# Altium schematic sheet SensorBoard.SchDoc: GROUND WATER MONITORING SYSTEM (part 1 of 2)
size C; DrawnBy: Md. Mizanur Rahman; Engineer: Md. Mizanur Rahman; Revision: 0.1
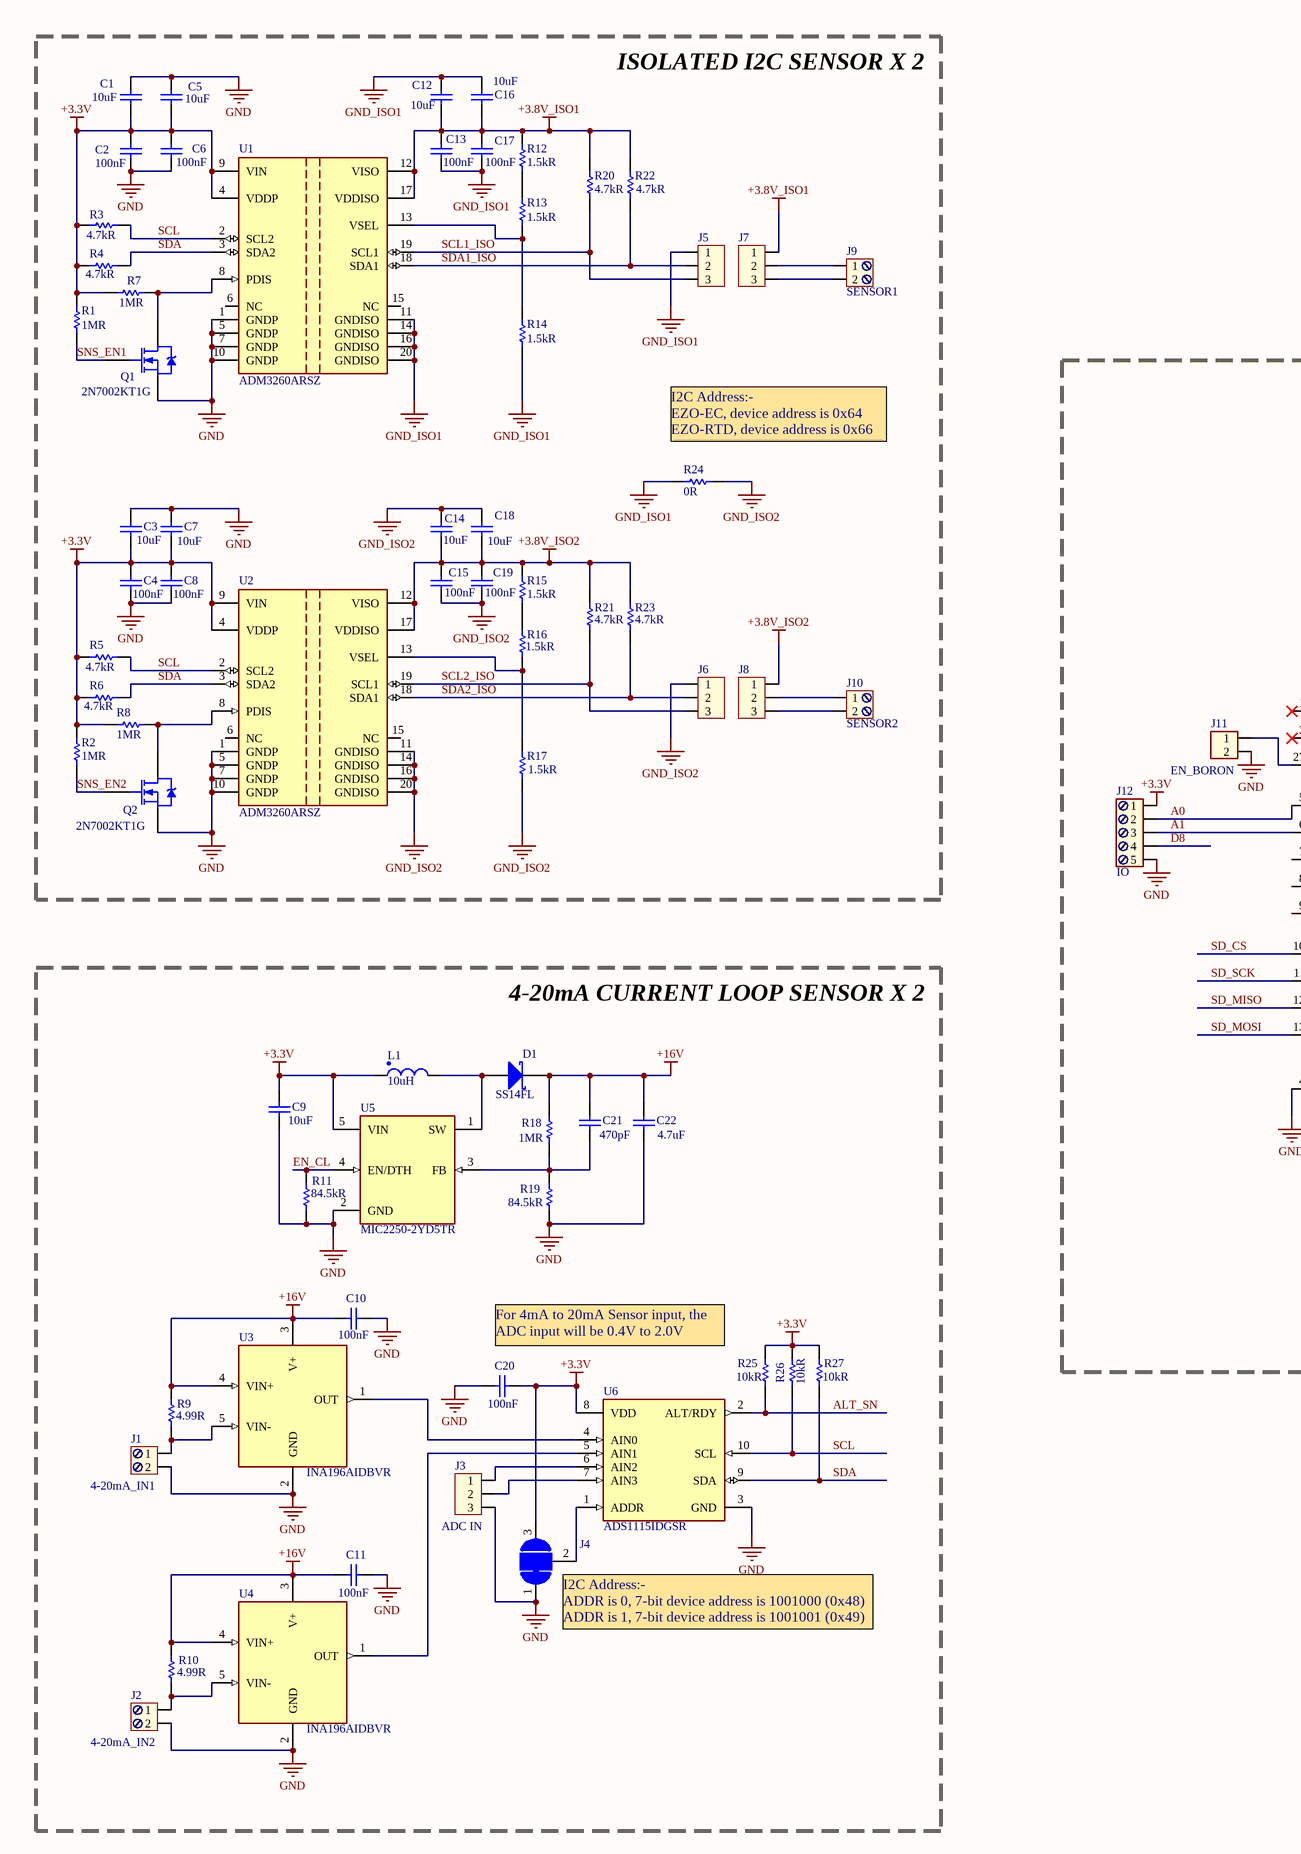
[diagram p0: SensorBoard.SchDoc, left]
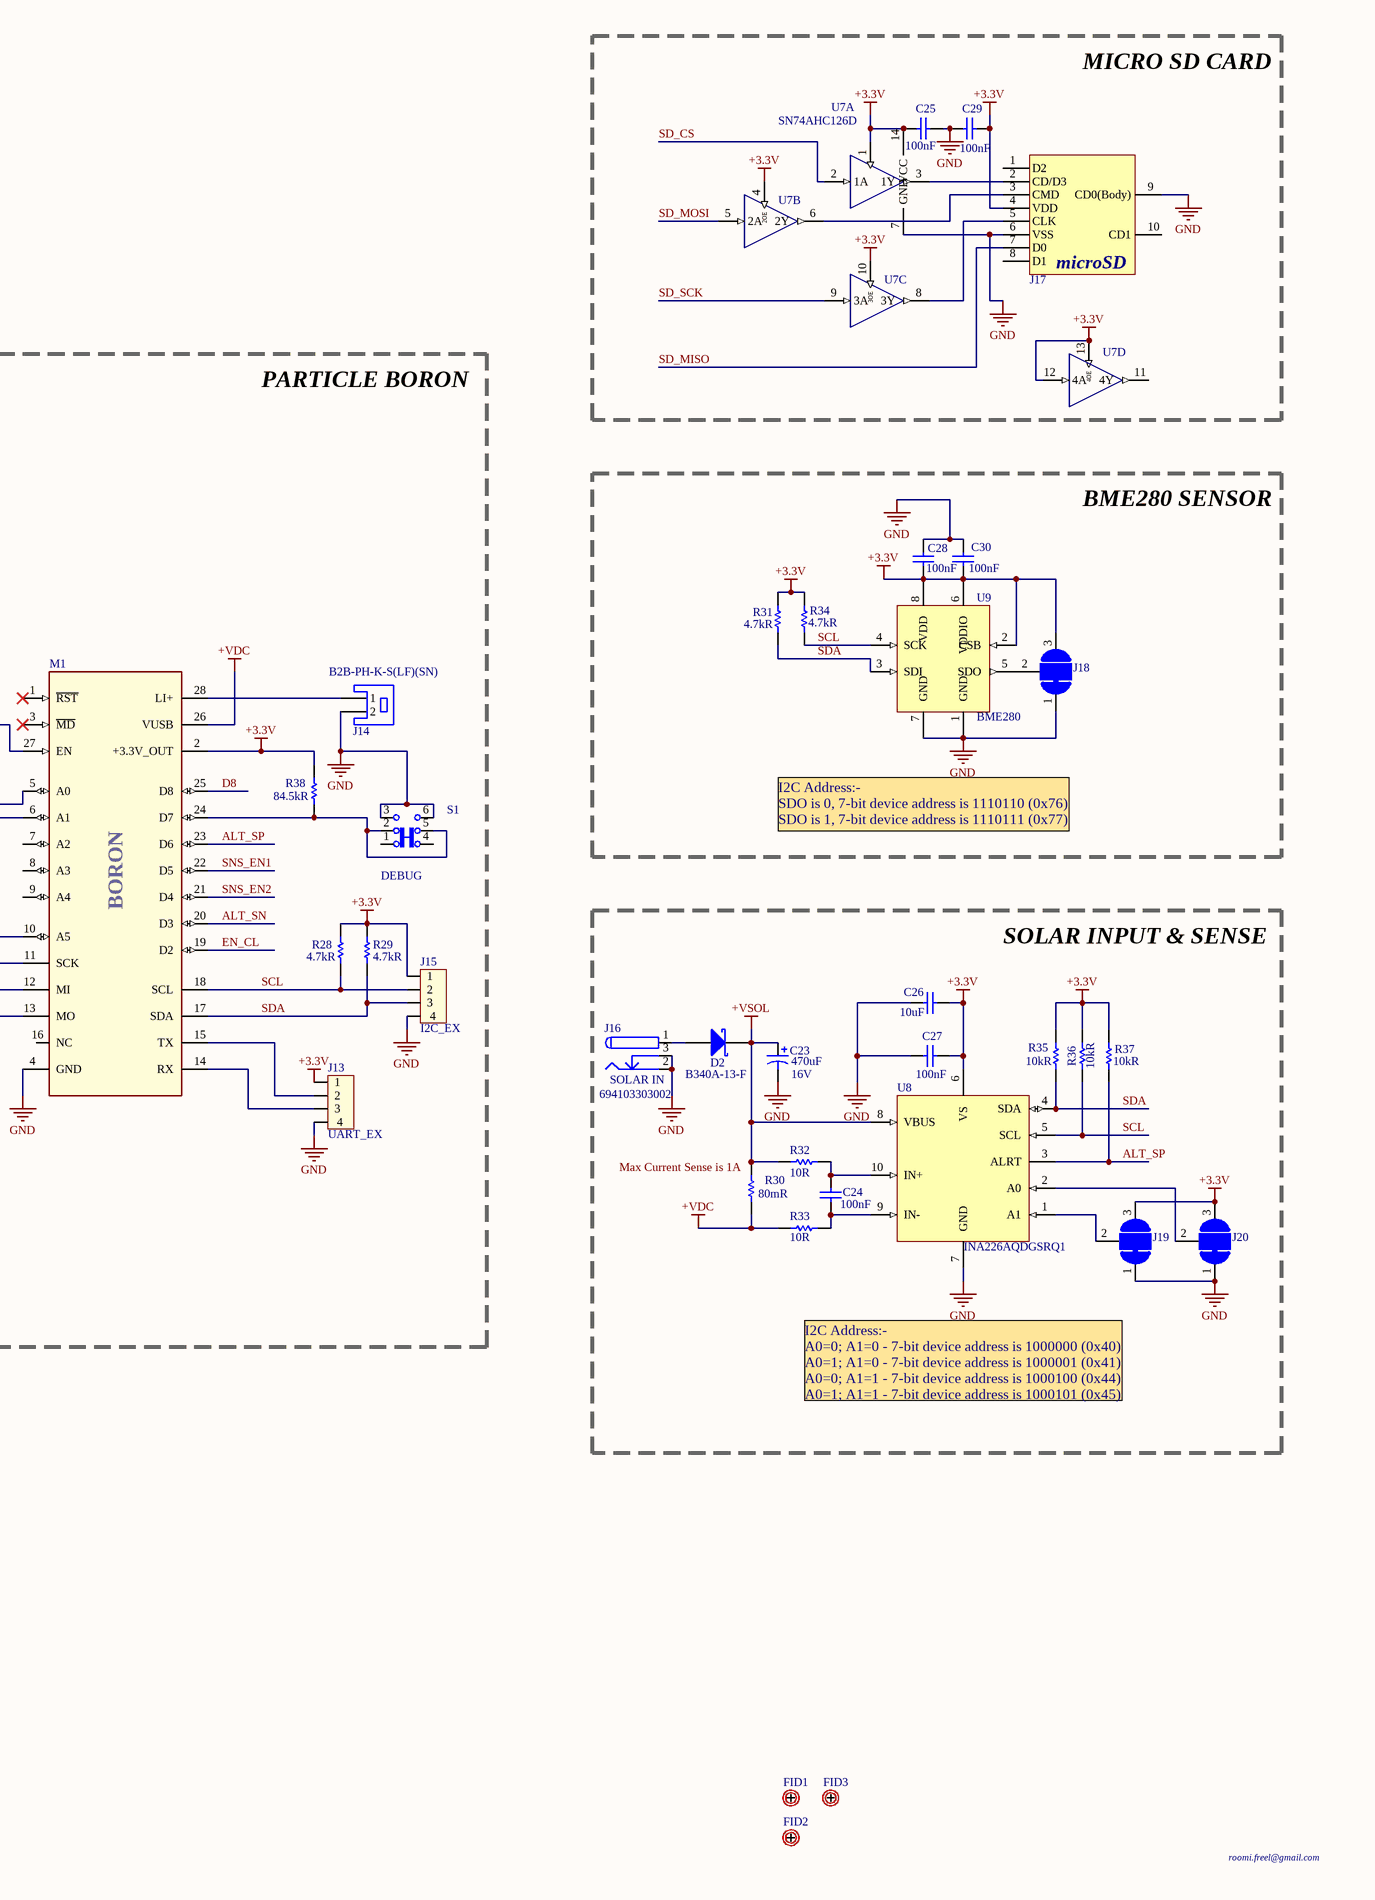
[diagram p1: SensorBoard.SchDoc, right]

## Parts
C1  10uF  [C1206]
C2  100nF  [C0805]
C3  10uF  [C1206]
C4  100nF  [C0805]
C5  10uF  [C1206]
C6  100nF  [C0805]
C7  10uF  [C1206]
C8  100nF  [C0805]
C9  10uF  [C1206]
C10  100nF  [C0805]
C11  100nF  [C0805]
C12  10uF  [C1206]
C13  100nF  [C0805]
C14  10uF  [C1206]
C15  100nF  [C0805]
C16  10uF  [C1206]
C17  100nF  [C0805]
C18  10uF  [C1206]
C19  100nF  [C0805]
C20  100nF  [C0805]
C21  470pF  [C0805]
C22  4.7uF  [C1206]
C23  Voltage Rating (DC): 16V  [CAPAE120103X102N]  (hidden comment: 470uF)
C24  100nF  [C0805]
C25  100nF  [C0805]
C26  10uF  [C1206]
C27  100nF  [C0805]
C28  100nF  [C0805]
C29  100nF  [C0805]
C30  100nF  [C0805]
D1  Manufacturer Part Number: SS14FL  [SOD-123F]  (hidden comment: Diode_Schottky)
D2  Manufacturer Part Number: B340A-13-F  [SMA (DO-214AC)]  (hidden comment: Diode_Schottky)
FID1  Fiducials  [FID_Round]  (value not drawn)  (no BOM)
FID2  Fiducials  [FID_Round]  (value not drawn)  (no BOM)
FID3  Fiducials  [FID_Round]  (value not drawn)  (no BOM)
J1  4-20mA_IN1  [TB-2P-5.08mm]
J2  4-20mA_IN2  [TB-2P-5.08mm]
J3  ADC IN  [TH,POS-3S, 2.54mm]
J4  Jumper 3 Pins Normally Closed  [Jumper3P -NC]  (value not drawn)  (net tie, no BOM)
J5  HDR 1X3  [TH,POS-3S,RCPTCL, 2.54mm]  (value not drawn)
J6  HDR 1X3  [TH,POS-3S,RCPTCL, 2.54mm]  (value not drawn)
J7  HDR 1X3  [TH,POS-3S,RCPTCL, 2.54mm]  (value not drawn)
J8  HDR 1X3  [TH,POS-3S,RCPTCL, 2.54mm]  (value not drawn)
J9  SENSOR1  [TB-2P-5.08mm]
J10  SENSOR2  [TB-2P-5.08mm]
J11  EN_BORON  [TH,POS-2S, 2.54mm]
J12  IO  [TB-5P-5.08mm]
J13  UART_EX  [TH,POS-4S, 2.54mm]
J14  Manufacturer Part Number: B2B-PH-K-S(LF)(SN)  [JST-2P TH V/T 2.0mm]  (hidden comment: JST-2P)
J15  I2C_EX  [TH,POS-4S, 2.54mm]
J16  SOLAR IN  Manufacturer Part Number: 694103303002  [PWR_JACK_1.1x3.5mm]
J17  MicroSD  [MicroSD_H-10]  (value not drawn)
J18  Jumper 3 Pins Normally Closed  [Jumper3P -NC]  (value not drawn)  (net tie, no BOM)
J19  Jumper 3 Pins Normally Closed  [Jumper3P -NC]  (value not drawn)  (net tie, no BOM)
J20  Jumper 3 Pins Normally Closed  [Jumper3P -NC]  (value not drawn)  (net tie, no BOM)
L1  10uH  [INDP5050X40L]
M1  Manufacturer Part Number: BORON  [Particle Module]  (hidden comment: Particle)
Q1  Manufacturer Part Number: 2N7002KT1G  [SOT23]  (hidden comment: 2N7002)
Q2  Manufacturer Part Number: 2N7002KT1G  [SOT23]  (hidden comment: 2N7002)
R1  1MR  [R0805]
R2  1MR  [R0805]
R3  4.7kR  [R0805]
R4  4.7kR  [R0805]
R5  4.7kR  [R0805]
R6  4.7kR  [R0805]
R7  1MR  [R0805]
R8  1MR  [R0805]
R9  4.99R  [R0805]
R10  4.99R  [R0805]
R11  84.5kR  [R0805]
R12  1.5kR  [R0805]
R13  1.5kR  [R0805]
R14  1.5kR  [R0805]
R15  1.5kR  [R0805]
R16  1.5kR  [R0805]
R17  1.5kR  [R0805]
R18  1MR  [R0805]
R19  84.5kR  [R0805]
R20  4.7kR  [R0805]
R21  4.7kR  [R0805]
R22  4.7kR  [R0805]
R23  4.7kR  [R0805]
R24  value 0R  [R0805]  (hidden comment: DNP)
R25  10kR  [R0805]
R26  10kR  [R0805]
R27  10kR  [R0805]
R28  4.7kR  [R0805]
R29  4.7kR  [R0805]
R30  80mR  [R2512]
R31  4.7kR  [R0805]
R32  10R  [R0805]
R33  10R  [R0805]
R34  4.7kR  [R0805]
R35  10kR  [R0805]
R36  10kR  [R0805]
R37  10kR  [R0805]
R38  84.5kR  [R0805]
S1  DEBUG  [Slide_DPDT_TH1]
U1  ADM3260ARSZ  [SSOP-20]
U2  ADM3260ARSZ  [SSOP-20]
U3  INA196AIDBVR  [SOT23-5]
U4  INA196AIDBVR  [SOT23-5]
U5  MIC2250-2YD5TR  [SOT23-5]
U6  ADS1115IDGSR  [VSSOP-10]
U7  SN74AHC126D  [SOIC-14]  (parts A,B,C,D of 4)
U8  INA226AQDGSRQ1  [MSOP-10]
U9  BME280  [LGA-8 -1]

## Blocks framed on the sheet
ISOLATED I2C SENSOR X 2: C1-C8 C12-C19 J5-J10 Q1 Q2 R1-R8 R12-R17 R20-R24 U1 U2
MICRO SD CARD: C25 C29 J17 U7
PARTICLE BORON: J11-J15 M1 R28 R29 R38 S1
BME280 SENSOR: C28 C30 J18 R31 R34 U9
SOLAR INPUT & SENSE: C23 C24 C26 C27 D2 J16 J19 J20 R30 R32 R33 R35-R37 U8
4-20mA CURRENT LOOP SENSOR X 2: C9-C11 C20-C22 D1 J1-J4 L1 R9-R11 R18 R19 R25-R27 U3-U6

## Nets
+3.3V: C1.2 C2.1 C3.2 C4.1 C5.2 C6.1 C7.2 C8.1 C9.2 C20.2 C25.2 C26.1 C27.1 C28.2 C29.1 C30.2 J4.3 J12.1 J13.1 J15.1 J17.4(VDD) J18.3 J19.3 J20.3 L1.1 M1.2(+3.3V_OUT) R1.2 R2.2 R3.2 R4.2 R5.2 R6.2 R7.2 R8.2 R25.2 R26.2 R27.2 R28.2 R29.2 R31.2 R34.2 R35.2 R36.2 R37.2 R38.2 U1.4(VDDP) U1.9(VIN) U2.4(VDDP) U2.9(VIN) U5.5(VIN) U6.8(VDD) U7.1(1OE) U7.4(2OE) U7.10(3OE) U7.12(4A) U7.13(4OE) U7.14(VCC) U8.6(VS) U9.2(CSB) U9.6(VDDIO) U9.8(VDD)
+3.8V_ISO1: C12.2 C13.1 C16.2 C17.1 J7.1 R12.2 R20.2 R22.2 U1.12(VISO) U1.17(VDDISO)
+3.8V_ISO2: C14.2 C15.1 C18.2 C19.1 J8.1 R15.2 R21.2 R23.2 U2.12(VISO) U2.17(VDDISO)
+16V: C10.1 C11.1 C21.2 C22.2 D1.2(K) R9.2 R10.2 R18.2 U3.3(V+) U3.4(VIN+) U4.3(V+) U4.4(VIN+)
+VDC: M1.26(VUSB) R30.1 R33.2
+VSOL: C23.1 D2.2(K) R30.2 R32.2 U8.8(VBUS)
GND: C1.1 C2.2 C3.1 C4.2 C5.1 C6.2 C7.1 C8.2 C9.1 C10.2 C11.2 C20.1 C22.1 C23.2 C25.1 C26.2 C27.2 C28.1 C29.2 C30.1 J1.2 J2.2 J3.3 J4.1 J11.2 J12.5 J13.4 J14.2 J15.4 J16.2 J16.3 J17.6(VSS) J17.9(CD0(Body)) J18.1 J19.1 J20.1 M1.4(GND) Q1.2(S) Q2.2(S) R11.1 R19.1 S1.3 S1.6 U1.1(GNDP) U1.5(GNDP) U1.7(GNDP) U1.10(GNDP) U2.1(GNDP) U2.5(GNDP) U2.7(GNDP) U2.10(GNDP) U3.2(GND) U4.2(GND) U5.2(GND) U6.3(GND) U7.7(GND) U8.7(GND) U9.1(GND) U9.7(GND)
GND_ISO1: C12.1 C13.2 C16.1 C17.2 J5.1 R14.1 R24.2 U1.11(GNDISO) U1.14(GNDISO) U1.16(GNDISO) U1.20(GNDISO)
GND_ISO2: C14.1 C15.2 C18.1 C19.2 J6.1 R17.1 R24.1 U2.11(GNDISO) U2.14(GNDISO) U2.16(GNDISO) U2.20(GNDISO)
A0: J12.2 M1.5(A0)
A1: J12.3 M1.6(A1)
ALT_SN: M1.20(D3) R25.1 U6.2(ALT/RDY)
ALT_SP: M1.23(D6) R37.1 U8.3(ALRT)
D8: J12.4 M1.25(D8)
EN_CL: M1.19(D2) R11.2 U5.4(EN/DTH)
SCL: J15.2 M1.18(SCL) R3.1 R5.1 R26.1 R28.1 R34.1 R36.1 U1.2(SCL2) U2.2(SCL2) U6.10(SCL) U8.5(SCL) U9.4(SCK)
SCL1_ISO: J5.3 R20.1 U1.19(SCL1)
SCL2_ISO: J6.3 R21.1 U2.19(SCL1)
SD_CS: M1.10(A5) U7.2(1A)
SD_MISO: J17.7(D0) M1.12(MI)
SD_MOSI: M1.13(MO) U7.5(2A)
SD_SCK: M1.11(SCK) U7.9(3A)
SDA: J15.3 M1.17(SDA) R4.1 R6.1 R27.1 R29.1 R31.1 R35.1 U1.3(SDA2) U2.3(SDA2) U6.9(SDA) U8.4(SDA) U9.3(SDI)
SDA1_ISO: J5.2 R22.1 U1.18(SDA1)
SDA2_ISO: J6.2 R23.1 U2.18(SDA1)
SNS_EN1: M1.22(D5) Q1.1(G) R1.1
SNS_EN2: M1.21(D4) Q2.1(G) R2.1
NetC21_1: C21.1 R18.1 R19.2 U5.3(FB)
NetC24_1: C24.1 R32.1 U8.10(IN+)
NetC24_2: C24.2 R33.1 U8.9(IN-)
NetD1_1: D1.1(A) L1.2 U5.1(SW)
NetD2_1: D2.1(A) J16.1
NetJ1_1: J1.1 R9.1 U3.5(VIN-)
NetJ2_1: J2.1 R10.1 U4.5(VIN-)
NetJ3_1: J3.1 U6.6(AIN2)
NetJ3_2: J3.2 U6.7(AIN3)
NetJ4_2: J4.2 U6.1(ADDR)
NetJ7_2: J7.2 J9.1
NetJ7_3: J7.3 J9.2
NetJ8_2: J8.2 J10.1
NetJ8_3: J8.3 J10.2
NetJ11_1: J11.1 M1.27(EN)
NetJ13_2: J13.2 M1.15(TX)
NetJ13_3: J13.3 M1.14(RX)
NetJ14_1: J14.1 M1.28(LI+)
NetJ17_2: J17.2(CD/D3) U7.3(1Y)
NetJ17_3: J17.3(CMD) U7.6(2Y)
NetJ17_5: J17.5(CLK) U7.8(3Y)
NetJ18_2: J18.2 U9.5(SDO)
NetJ19_2: J19.2 U8.1(A1)
NetJ20_2: J20.2 U8.2(A0)
NetM1_24: M1.24(D7) R38.1 S1.2 S1.5
NetQ1_3: Q1.3(D) R7.1 U1.8(PDIS)
NetQ2_3: Q2.3(D) R8.1 U2.8(PDIS)
NetR12_1: R12.1 R13.2
NetR13_1: R13.1 R14.2 U1.13(VSEL)
NetR15_1: R15.1 R16.2
NetR16_1: R16.1 R17.2 U2.13(VSEL)
NetU3_1: U3.1(OUT) U6.4(AIN0)
NetU4_1: U4.1(OUT) U6.5(AIN1)

Not connected (* = marked no-connect by the designer): FID1 1; FID2 1; FID3 1; J17 1(D2) 8(D1) 10(CD1); M1 1(~{RST})* 3(~{MD})* 7(A2) 8(A3) 9(A4) 16(NC); S1 1 4; U1 6(NC) 15(NC); U2 6(NC) 15(NC); U7 11(4Y)

## Notes on the sheet
- (near R24) I2C Address:-
  EZO-EC, device address is 0x64
  EZO-RTD, device address is 0x66
- I2C Address:-
  SDO is 0, 7-bit device address is 1110110 (0x76)
  SDO is 1, 7-bit device address is 1110111 (0x77)
- (near R30) Max Current Sense is 1A
- For 4mA to 20mA Sensor input, the ADC input will be 0.4V to 2.0V
- I2C Address:-
  A0=0; A1=0 - 7-bit device address is 1000000 (0x40)
  A0=1; A1=0 - 7-bit device address is 1000001 (0x41)
  A0=0; A1=1 - 7-bit device address is 1000100 (0x44)
  A0=1; A1=1 - 7-bit device address is 1000101 (0x45)
- (near J4) I2C Address:-
  ADDR is 0, 7-bit device address is 1001000 (0x48)
  ADDR is 1, 7-bit device address is 1001001 (0x49)
- roomi.freel@gmail.com
- (in symbol MicroSD) microSD